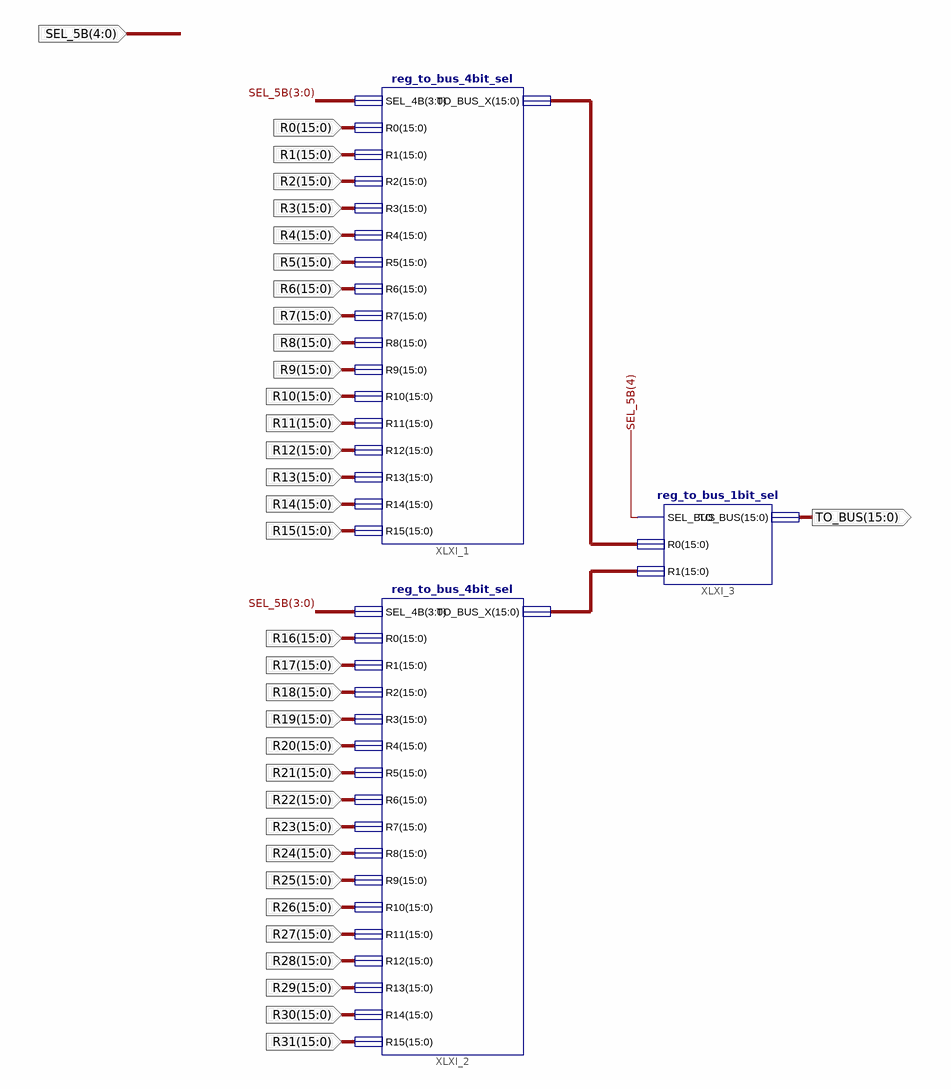
[diagram p0: schematic sheet 1]
// Xilinx ISE schematic reg_to_bus_5bit_sel.sch (artix7) as structural Verilog: 3 symbols, 34 ports
module reg_to_bus_5bit_sel (
  input  [4:0] SEL_5B,
  input  [15:0] R0,
  input  [15:0] R1,
  input  [15:0] R2,
  input  [15:0] R3,
  input  [15:0] R4,
  input  [15:0] R5,
  input  [15:0] R6,
  input  [15:0] R7,
  input  [15:0] R8,
  input  [15:0] R9,
  input  [15:0] R10,
  input  [15:0] R11,
  input  [15:0] R12,
  input  [15:0] R13,
  input  [15:0] R14,
  input  [15:0] R15,
  input  [15:0] R16,
  input  [15:0] R17,
  input  [15:0] R18,
  input  [15:0] R19,
  input  [15:0] R20,
  input  [15:0] R21,
  input  [15:0] R22,
  input  [15:0] R23,
  input  [15:0] R24,
  input  [15:0] R25,
  input  [15:0] R26,
  input  [15:0] R27,
  input  [15:0] R28,
  input  [15:0] R29,
  input  [15:0] R30,
  input  [15:0] R31,
  output [15:0] TO_BUS
);

  wire [15:0] XLXN_1, XLXN_2;

  reg_to_bus_4bit_sel XLXI_1 (
    .SEL_4B(SEL_5B[3:0]), .R0(R0), .R1(R1), .R2(R2), .R3(R3), .R4(R4), .R5(R5), .R6(R6), .R7(R7), .R8(R8),
    .R9(R9), .R10(R10), .R11(R11), .R12(R12), .R13(R13), .R14(R14), .R15(R15), .TO_BUS_X(XLXN_1));
  reg_to_bus_4bit_sel XLXI_2 (
    .SEL_4B(SEL_5B[3:0]), .R0(R16), .R1(R17), .R2(R18), .R3(R19), .R4(R20), .R5(R21), .R6(R22), .R7(R23),
    .R8(R24), .R9(R25), .R10(R26), .R11(R27), .R12(R28), .R13(R29), .R14(R30), .R15(R31), .TO_BUS_X(XLXN_2));
  reg_to_bus_1bit_sel XLXI_3 (.SEL_BUS(SEL_5B[4]), .R0(XLXN_1), .R1(XLXN_2), .TO_BUS(TO_BUS));
endmodule
